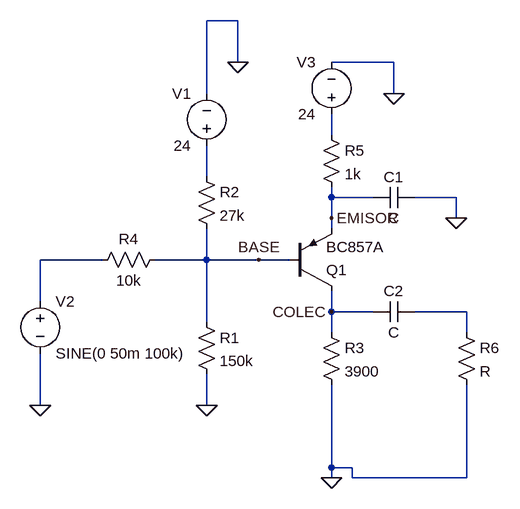
[diagram p0: schematic EjercicioParaEntregar.asc]
EjercicioParaEntregar.asc, the LTspice schematic file:
Version 4
SHEET 1 880 680
WIRE -32 -240 -80 -240
WIRE -32 -176 -32 -240
WIRE 208 -176 112 -176
WIRE -80 -128 -80 -240
WIRE 208 -128 208 -176
WIRE 112 -64 112 -96
WIRE -80 0 -80 -48
WIRE 112 32 112 16
WIRE 176 32 112 32
WIRE 304 32 240 32
WIRE 112 64 112 32
WIRE 304 64 304 32
WIRE 112 80 112 64
WIRE -240 128 -336 128
WIRE -80 128 -80 80
WIRE -80 128 -160 128
WIRE 0 128 -80 128
WIRE 48 128 0 128
WIRE -336 192 -336 128
WIRE 112 208 112 176
WIRE 176 208 112 208
WIRE 320 208 240 208
WIRE -80 224 -80 128
WIRE 112 240 112 208
WIRE 320 240 320 208
WIRE -336 352 -336 272
WIRE -80 352 -80 304
WIRE 112 448 112 320
WIRE 144 448 112 448
WIRE 112 464 112 448
WIRE 144 464 144 448
WIRE 320 464 320 320
WIRE 320 464 144 464
FLAG -32 -176 0
FLAG -80 352 0
FLAG 112 464 0
FLAG 208 -128 0
FLAG 0 128 BASE
FLAG 112 64 EMISOR
FLAG 112 208 COLEC
FLAG -336 352 0
FLAG 304 64 0
SYMBOL res -96 208 R0
SYMATTR InstName R1
SYMATTR Value 150k
SYMBOL res -96 -16 R0
SYMATTR InstName R2
SYMATTR Value 27k
SYMBOL res 96 224 R0
SYMATTR InstName R3
SYMATTR Value 3900
SYMBOL res 96 -80 R0
SYMATTR InstName R5
SYMATTR Value 1k
SYMBOL voltage -80 -32 R180
WINDOW 0 24 96 Left 2
WINDOW 3 24 16 Left 2
WINDOW 123 0 0 Left 0
WINDOW 39 0 0 Left 0
SYMATTR InstName V1
SYMATTR Value 24
SYMBOL voltage 112 -80 R180
WINDOW 0 24 96 Left 2
WINDOW 3 24 16 Left 2
WINDOW 123 0 0 Left 0
WINDOW 39 0 0 Left 0
SYMATTR InstName V3
SYMATTR Value 24
SYMBOL pnp 48 176 M180
SYMATTR InstName Q1
SYMATTR Value BC857A
SYMBOL voltage -336 176 R0
WINDOW 123 0 0 Left 0
WINDOW 39 0 0 Left 0
SYMATTR InstName V2
SYMATTR Value SINE(0 50m 100k)
SYMBOL res -144 112 R90
WINDOW 0 0 56 VBottom 2
WINDOW 3 32 56 VTop 2
SYMATTR InstName R4
SYMATTR Value 10k
SYMBOL cap 240 16 R90
WINDOW 0 0 32 VBottom 2
WINDOW 3 32 32 VTop 2
SYMATTR InstName C1
SYMBOL cap 240 192 R90
WINDOW 0 0 32 VBottom 2
WINDOW 3 32 32 VTop 2
SYMATTR InstName C2
SYMBOL res 304 224 R0
SYMATTR InstName R6

The netlist it stands for:
* EjercicioParaEntregar.asc
R1 BASE 0 150k
R2 N002 BASE 27k
R3 COLEC 0 3900
R5 N001 EMISOR 1k
V1 N002 0 24
V3 N001 0 24
Q1 COLEC BASE EMISOR 0 BC857A
V2 N003 0 SINE(0 50m 100k)
R4 BASE N003 10k
C1 0 EMISOR C
C2 N004 COLEC C
R6 N004 0 R
.model NPN NPN
.model PNP PNP
.lib standard.bjt
.backanno
.end